# Altium schematic sheet STRWL-S06-V00-Peripherals.SchDoc: Peripherals
size A3; DrawnBy: John Hatfield; SheetNumber: 6; SheetTotal: 6
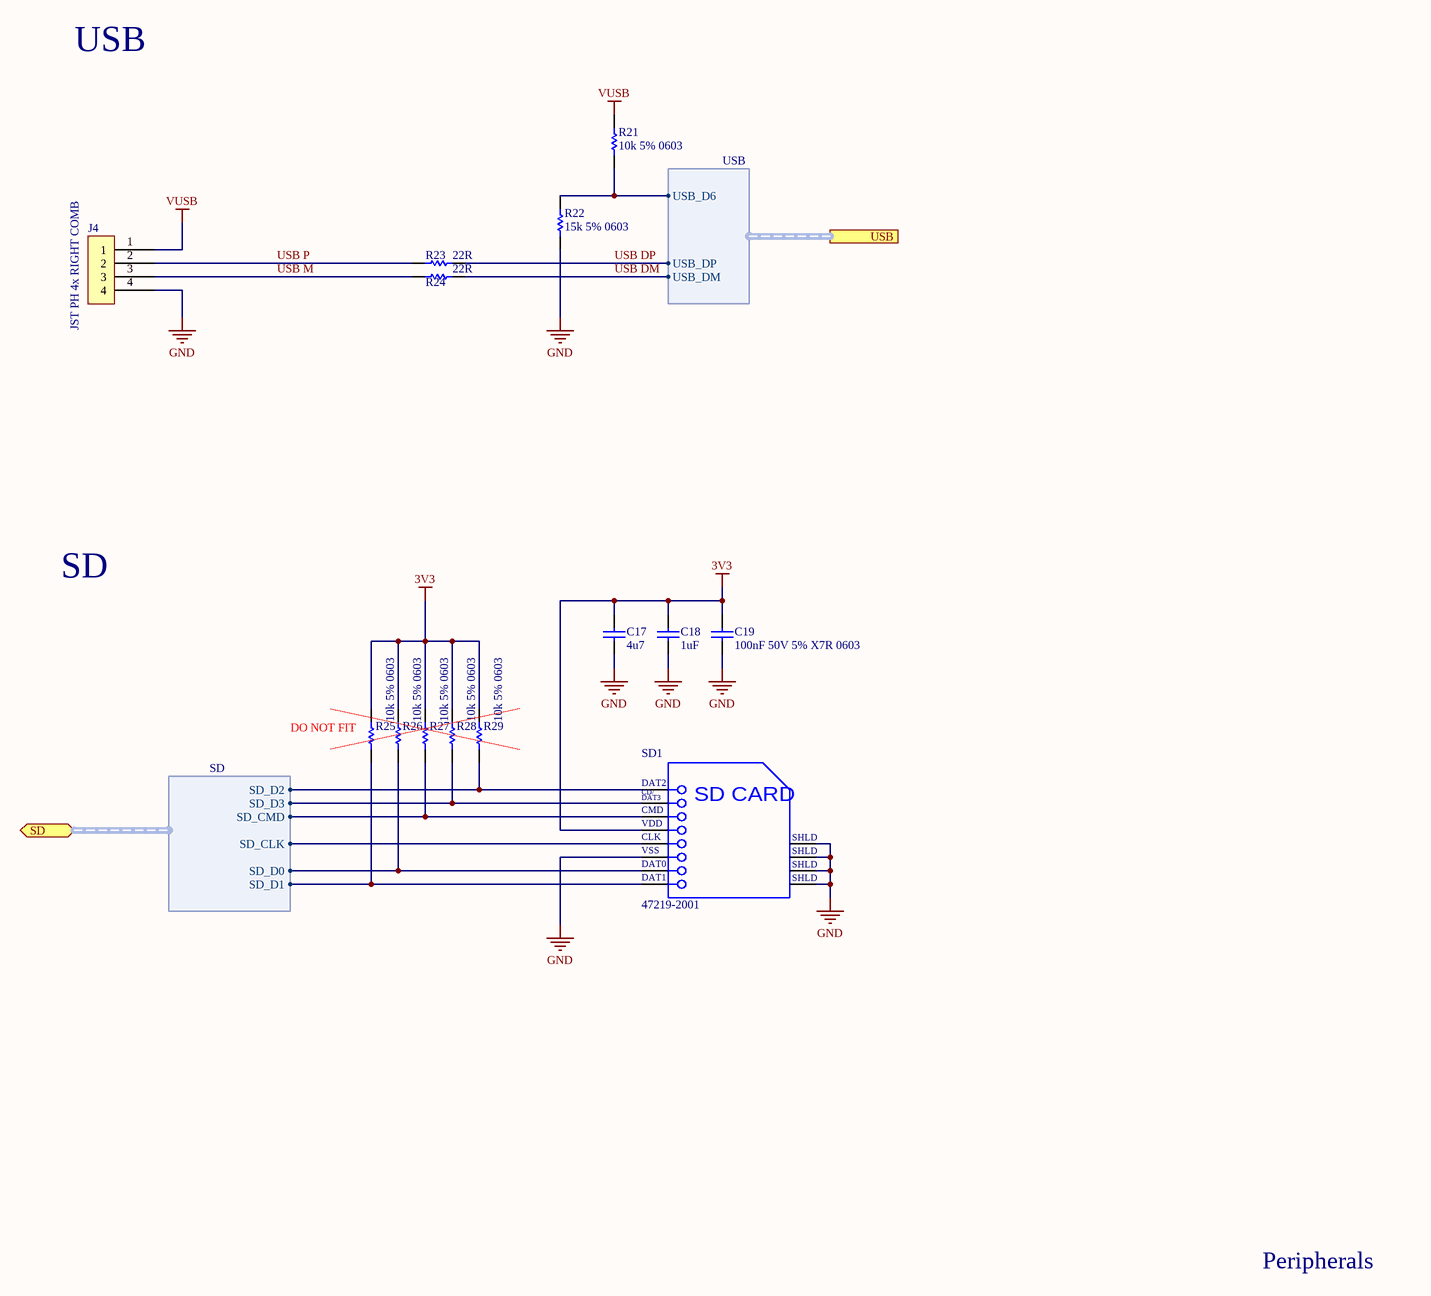
[diagram p0: STRWL-S06-V00-Peripherals.SchDoc]

## Parts
C17  4u7  [Cap_Ceramic_0603]
C18  1uF  [Cap_Ceramic_0603]
C19  100nF 50V 5% X7R 0603  [Cap_Ceramic_0603]
J4  JST PH 4x RIGHT COMB  [JST PH 4x RIGHT COMB]
R21  10k 5% 0603  [Res_ThinFilm_0603]
R22  15k 5% 0603  [Res_ThinFilm_0603]
R23  22R  [Res_ThinFilm_0603]
R24  22R  [Res_ThinFilm_0603]
R25  10k 5% 0603  [Res_ThinFilm_0603]
R26  10k 5% 0603  [Res_ThinFilm_0603]
R27  10k 5% 0603  [Res_ThinFilm_0603]
R28  10k 5% 0603  [Res_ThinFilm_0603]
R29  10k 5% 0603  [Res_ThinFilm_0603]
SD1  47219-2001  [47219-2001]

## Ports
SD (bidir, harness SD), USB (harness USB)

## Harnesses
USB: USB_DP, USB_D6, USB_DM
SD: SD_D2, SD_D3, SD_CMD, SD_CLK, SD_D0, SD_D1

## Nets
3V3: C17.2 C18.2 C19.2 R25.2 R26.2 R27.2 R28.2 R29.2 SD1.4(VDD)
GND: C17.1 C18.1 C19.1 J4.4 R22.1 SD1.6(VSS) SD1.9(SHLD) SD1.10(SHLD) SD1.11(SHLD) SD1.12(SHLD)
VUSB: J4.1 R21.2
USB DM: R24.2 ; port USB.USB_DM
USB DP: R23.2 ; port USB.USB_DP
USB M: J4.3 R24.1
USB P: J4.2 R23.1
NetR21_1: R21.1 R22.2 ; port USB.USB_D6
NetR25_1: R25.1 SD1.8(DAT1) ; port SD.SD_D1
NetR26_1: R26.1 SD1.7(DAT0) ; port SD.SD_D0
NetR27_1: R27.1 SD1.3(CMD) ; port SD.SD_CMD
NetR28_1: R28.1 SD1.2(CD/DAT3) ; port SD.SD_D3
NetR29_1: R29.1 SD1.1(DAT2) ; port SD.SD_D2
NetSD1_5: SD1.5(CLK) ; port SD.SD_CLK

## Notes on the sheet
- USB
- SD
- (near R25) DO NOT FIT
- Peripherals
- (in symbol 47219-2001) CD/; DAT3; SD CARD

## Library data of the parts
C17 = 4u7 50V 5% X7R 0603: Capacitor, Ceramic, SMD, 4u7, 50V, 5%, X7R, 0603
C18 = 1uF 25V 5% X7R 0603: Capacitor, Ceramic, SMD, 1uF, 25V, 5%, X7R, 0603
C19 = 100nF 50V 5% X7R 0603: Capacitor, Ceramic, SMD, 100nF, 50V, 5%, X7R, 0603
R21 R25-R29 = 10k 5% 0603: Resistor, SMD, 10k, 0.1W, 5%, 0603
R22 = 15k 5% 0603: Resistor, SMD, 15k, 0.1W, 5%, 0603
R23 R24 = 22R 1% 0603: Resistor, SMD, 22R, 0.1W, 1%, 0603
SD1 = 47219-2001: MicroSD Card Connector, Hinge Type, -40 to 85 degC, 8-Pin SMD, RoHS, Tape and Reel